# EAGLE design debouncersimple (EAGLE 9.4.2)
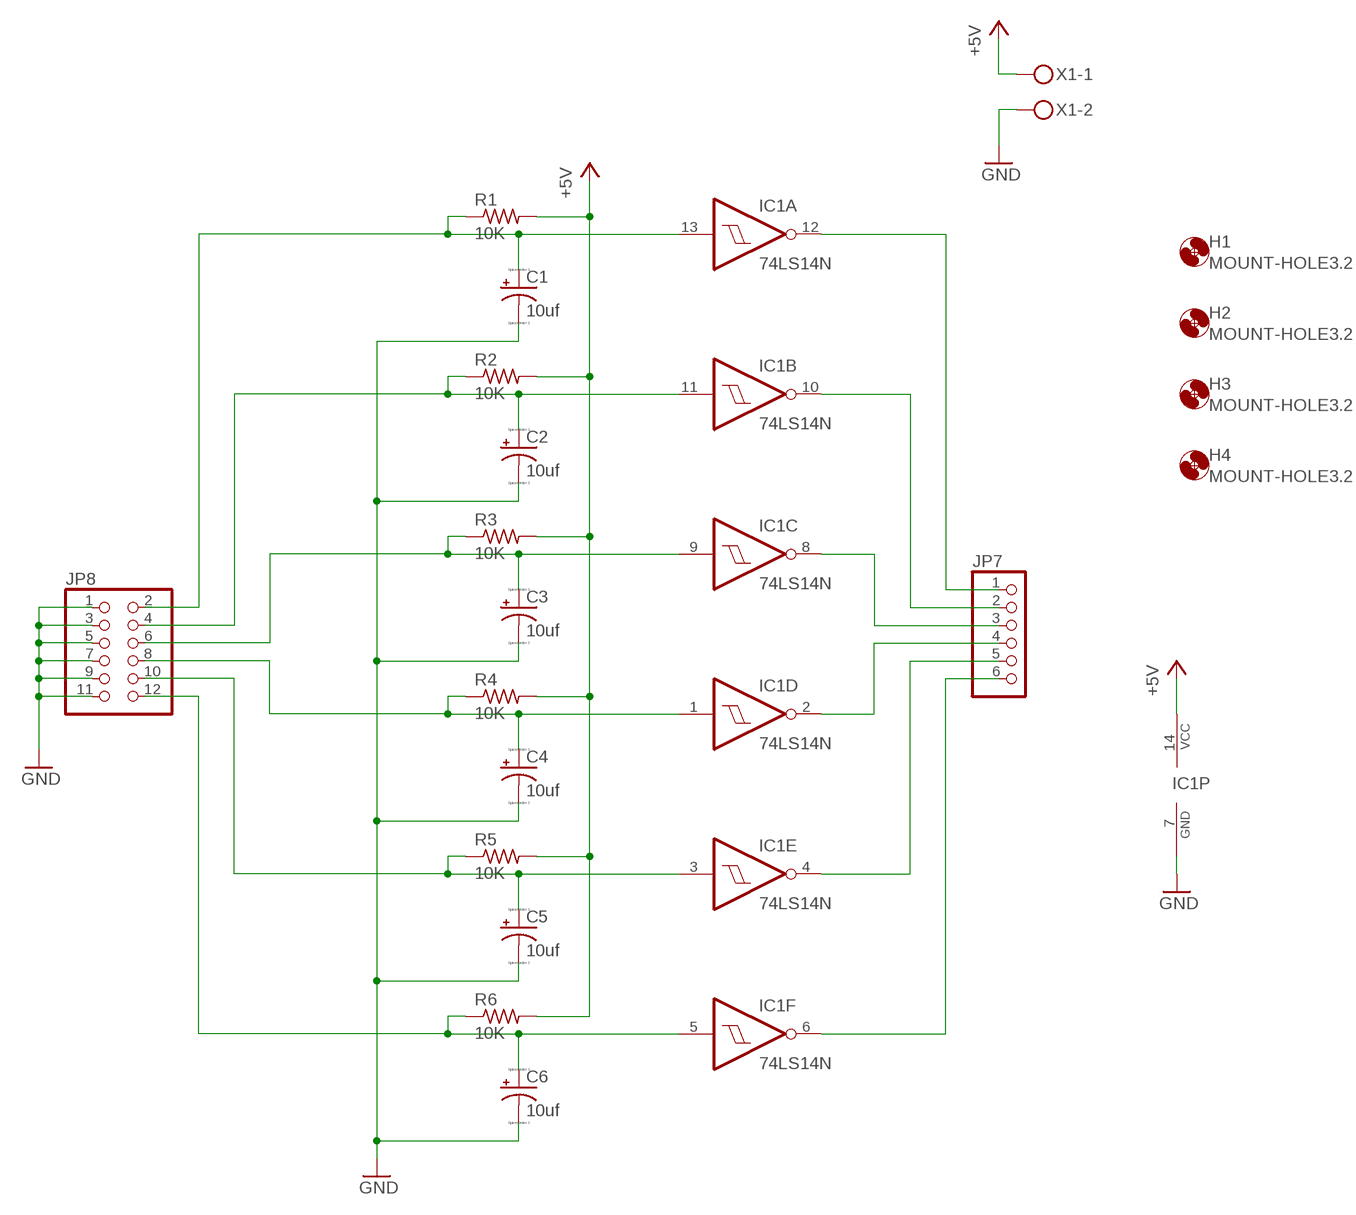
[diagram p0: schematic, sheet 1]

## Parts
C1  10uf  CPOL-USE2-5  [E2-5]
C2  10uf  CPOL-USE2-5  [E2-5]
C3  10uf  CPOL-USE2-5  [E2-5]
C4  10uf  CPOL-USE2-5  [E2-5]
C5  10uf  CPOL-USE2-5  [E2-5]
C6  10uf  CPOL-USE2-5  [E2-5]
H1  MOUNT-HOLE3.2  [3,2]
H2  MOUNT-HOLE3.2  [3,2]
H3  MOUNT-HOLE3.2  [3,2]
H4  MOUNT-HOLE3.2  [3,2]
IC1  74LS14N  [DIL14]
JP7  PINHD-1X6  [1X06]
JP8  PINHD-2X6  [2X06]
R1  10K  R-US_0207/2V  [0207/2V]
R2  10K  R-US_0207/2V  [0207/2V]
R3  10K  R-US_0207/2V  [0207/2V]
R4  10K  R-US_0207/2V  [0207/2V]
R5  10K  R-US_0207/2V  [0207/2V]
R6  10K  R-US_0207/2V  [0207/2V]
X1  MKDSN1,5/2-5,08  [MKDSN1,5/2-5,08]

## Nets
+5V: IC1.14(P:VCC) R1.2 R2.2 R3.2 R4.2 R5.2 R6.2 X1.1
GND: C1.- C2.- C3.- C4.- C5.- C6.- IC1.7(P:GND) JP8.1 JP8.3 JP8.5 JP8.7 JP8.9 JP8.11 X1.2
N$1: C1.+ IC1.13(A:I) JP8.2 R1.1
N$2: IC1.6(F:O) JP7.6
N$3: IC1.4(E:O) JP7.5
N$4: IC1.2(D:O) JP7.4
N$5: C2.+ IC1.11(B:I) JP8.4 R2.1
N$6: IC1.8(C:O) JP7.3
N$7: IC1.10(B:O) JP7.2
N$8: C3.+ IC1.9(C:I) JP8.6 R3.1
N$9: IC1.12(A:O) JP7.1
N$11: C4.+ IC1.1(D:I) JP8.8 R4.1
N$14: C5.+ IC1.3(E:I) JP8.10 R5.1
N$17: C6.+ IC1.5(F:I) JP8.12 R6.1

## Library data of the parts
C1-C6 = resistor:CPOL-US: POLARIZED CAPACITOR, American symbol
H1-H4 = holes:MOUNT-HOLE: MOUNTING HOLE with drill center marker
IC1 = 74xx-us:74*14: Hex schmitt trigger INVERTER
JP7 = pinhead:PINHD-1X6: PIN HEADER
JP8 = pinhead:PINHD-2X6: PIN HEADER
R1-R6 = resistor:R-US_: RESISTOR, American symbol
X1 = con-phoenix-508:MKDSN1,5/2-5,08: MKDSN 1,5/ 2-5,08 Printklemme Nennstrom: 13,5 A Nennspannung: 250 V Rastermaß: 5,08 mm Polzahl: 2 Anschlussart: Schraubanschluss Montage: Löten Anschlussrichtung Leiter/Platine: 0 ° Artikelnummer: 1729128 Source: http://eshop.phoenixcontact.com .. 1729128.pdf

## Board
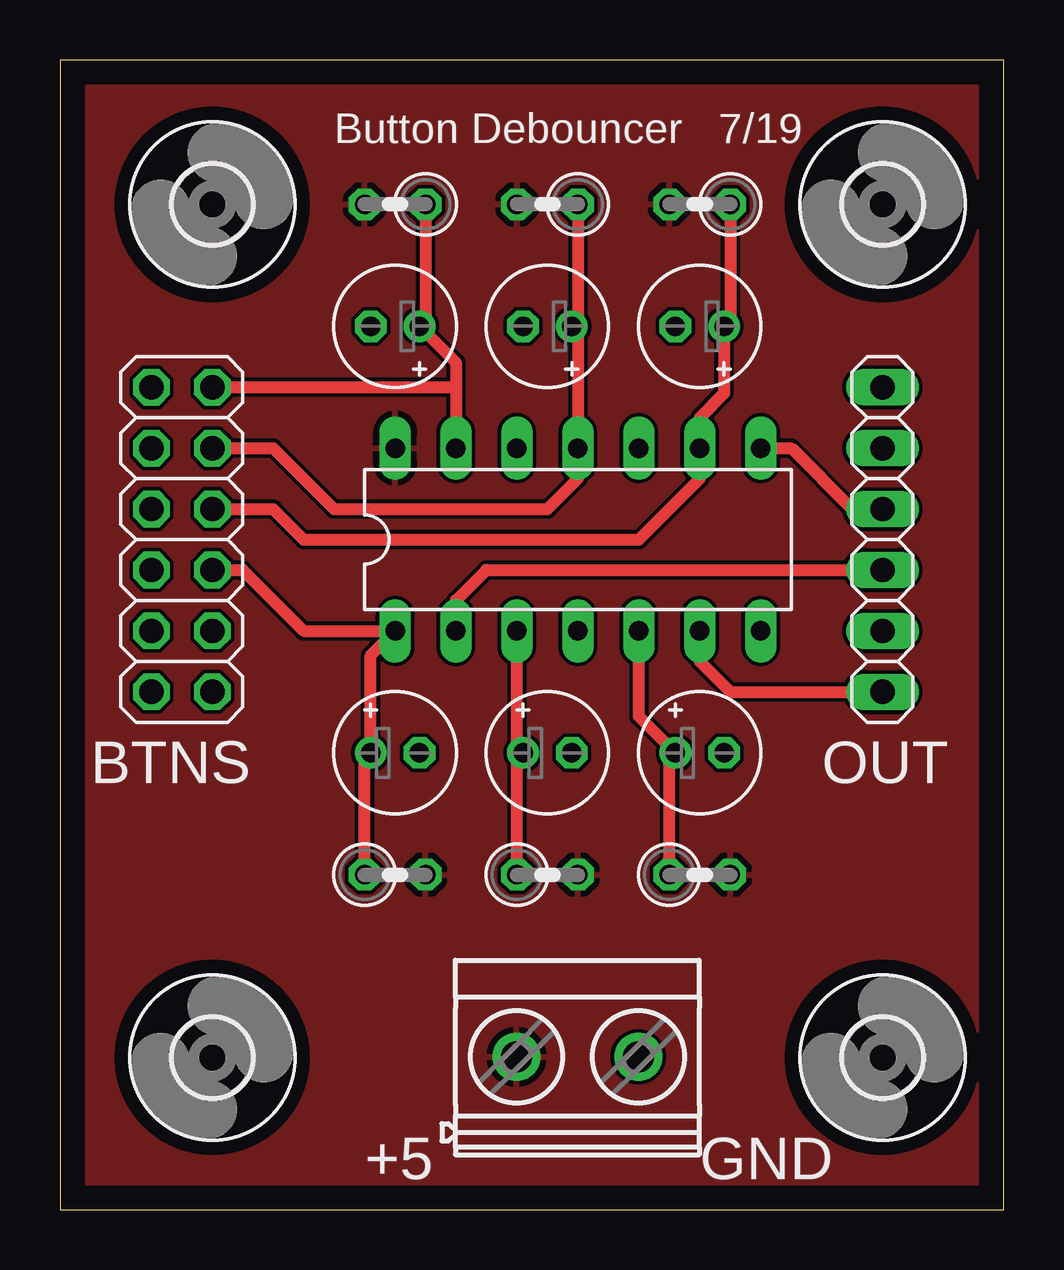
[diagram p1: board, top side]
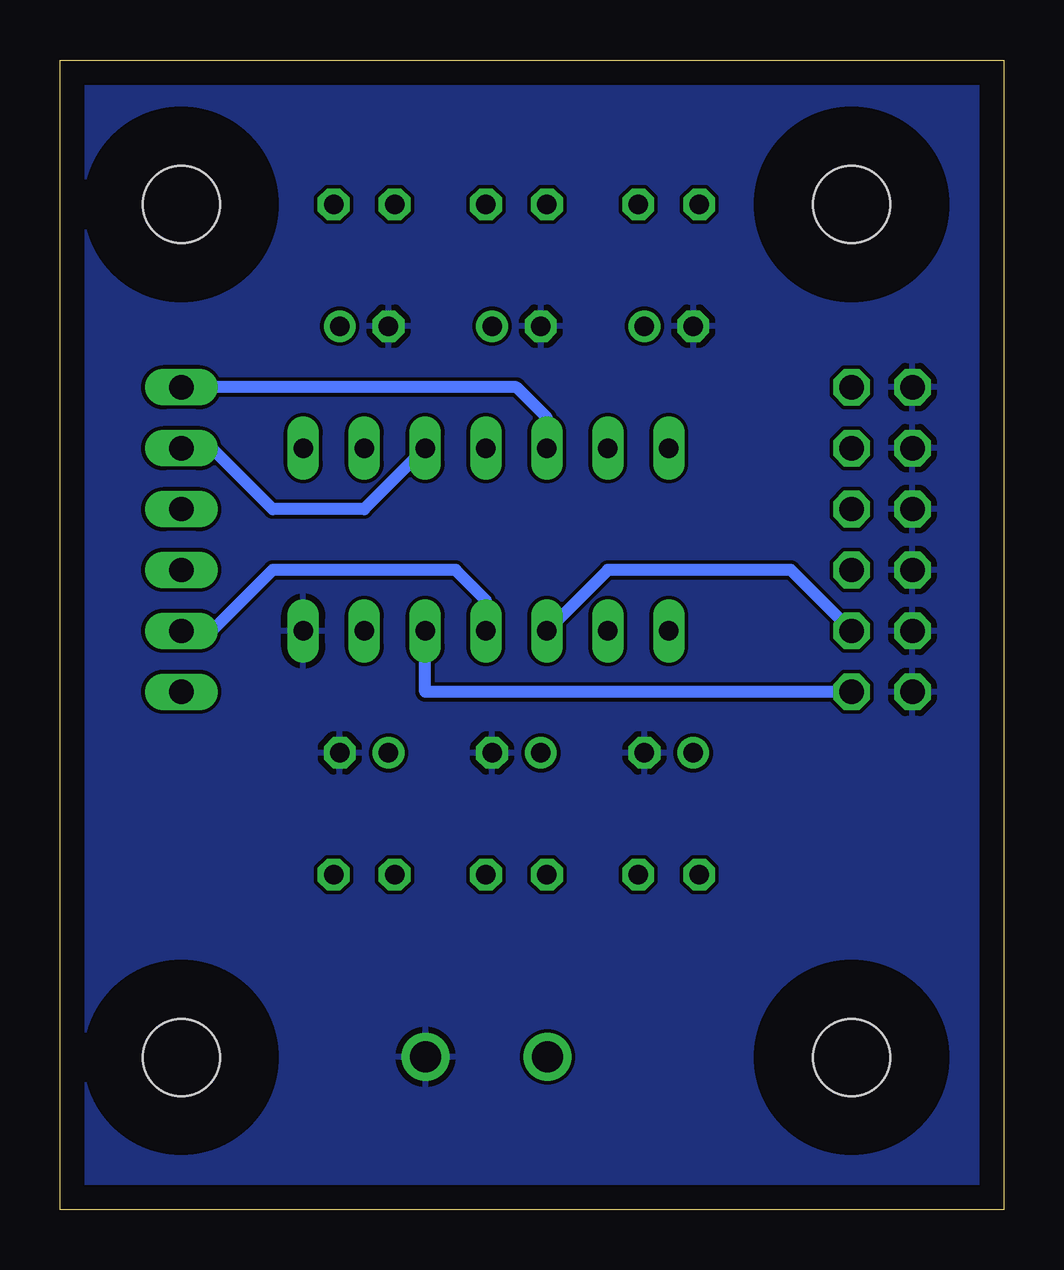
[diagram p2: board, bottom side, seen from below]

Size 39.35 x 47.93 mm. Coordinates in mm from the lower left corner, seen from the top.
Outline: 0,0 39.35,0 39.35,47.93 0,47.93 0,0
Copper layers (1*16): Top 0.035mm / dielectric 1.5mm / Bottom 0.035mm
Design rules "default": minimum track width 6mil, minimum drill 0.35mm, track to track 6mil, track to pad 6mil, pad to pad 6mil, via to via 6mil, smd to smd 6mil, copper to edge 40mil, drill to drill 6mil, minimum pad ring 10mil, minimum via ring 8mil, stop-mask expansion 4mil, vias tented up to drill 0mil, thermal gap 10mil

### Footprints (pad centres in the part's own frame; a part is rotated, then mirrored left to right if it is on the bottom)
E2-5 = drill 0.813 pad 1.27: + -1.016,0 | drill 0.813 pad 1.27 octagon: - 1.016,0
3,2 = hole 3.2: 0,0
DIL14 = drill 0.813 long: 1 -7.62,-3.81; 2 -5.08,-3.81; 3 -2.54,-3.81; 4 0,-3.81; 5 2.54,-3.81; 6 5.08,-3.81; 7 7.62,-3.81; 8 7.62,3.81; 9 5.08,3.81; 10 2.54,3.81; 11 0,3.81; 12 -2.54,3.81; 13 -5.08,3.81; 14 -7.62,3.81
1X06 = drill 1.016 long: 1 -6.35,0; 2 -3.81,0; 3 -1.27,0; 4 1.27,0; 5 3.81,0; 6 6.35,0
2X06 = drill 1.016 octagon: 1 -6.35,-1.27; 2 -6.35,1.27; 3 -3.81,-1.27; 4 -3.81,1.27; 5 -1.27,-1.27; 6 -1.27,1.27; 7 1.27,-1.27; 8 1.27,1.27; 9 3.81,-1.27; 10 3.81,1.27; 11 6.35,-1.27; 12 6.35,1.27
0207/2V = drill 0.813 octagon: 1 -1.27,0; 2 1.27,0
MKDSN1,5/2-5,08 = drill 1.3 pad 2: 1 -2.561,0.025; 2 2.519,0.025

### Placement (x,y rotation side)
C1  13.97,36.83 180 top
C2  20.32,36.83 180 top
C3  26.67,36.83 180 top
C4  13.97,19.05 0 top
C5  20.32,19.05 0 top
C6  26.67,19.05 0 top
H1  34.29,6.35 0 top
H2  6.35,41.91 0 top
H3  34.29,41.91 0 top
H4  6.35,6.35 0 top
IC1  21.59,27.94 0 top
JP7  34.29,27.94 270 top
JP8  5.08,27.94 270 top
R1  13.97,41.91 180 top
R2  20.32,41.91 180 top
R3  26.67,41.91 180 top
R4  13.97,13.97 0 top
R5  20.32,13.97 0 top
R6  26.67,13.97 0 top
X1  21.59,6.35 0 top

### Tracks (layer width: path | path; a pad name or v marks a point on that pad's centre or on a via)
+5V
  pour Top: -5.08,57.15 44.45,57.15 44.45,-3.81 -5.08,-3.81
GND
  pour Bottom: -10.16,53.34 41.91,53.34 41.91,0 -10.16,0
N$1
  Top 0.508: R1.1 15.24,37.08 C1.+ 16.51,35.31 16.51,34.29 | 16.51,34.29 IC1.13 | JP8.2 16.51,34.29
N$2
  Top 0.508: IC1.6 26.67,22.86 27.94,21.59 JP7.6
N$3
  Bottom 0.508: IC1.4 21.59,25.4 22.86,26.67 30.48,26.67 33.02,24.13 JP7.5
N$4
  Top 0.508: IC1.2 16.51,25.4 17.78,26.67 JP7.4
N$5
  Top 0.508: R2.1 21.59,37.08 C2.+ 21.59,36.58 IC1.11 21.59,30.48 20.32,29.21 11.43,29.21 8.89,31.75 JP8.4
N$6
  Top 0.508: IC1.8 30.48,31.75 33.02,29.21 JP7.3
N$7
  Bottom 0.508: IC1.10 26.67,29.21 30.48,29.21 33.02,31.75 JP7.2
N$8
  Top 0.508: R3.1 27.94,37.08 C3.+ 27.69,34.04 26.67,33.02 IC1.9 26.67,30.48 24.13,27.94 10.16,27.94 8.89,29.21 JP8.6
N$9
  Bottom 0.508: IC1.12 19.05,33.02 20.32,34.29 JP7.1
N$11
  Top 0.508: R4.1 12.7,18.8 C4.+ 12.95,23.11 IC1.1 10.16,24.13 7.62,26.67 JP8.8
N$14
  Top 0.508: R5.1 19.05,18.8 C5.+ 19.05,19.3 IC1.3
  Bottom 0.508: JP8.10 8.89,26.67 16.51,26.67 IC1.3
N$17
  Top 0.508: R6.1 25.4,18.8 C6.+ 24.13,20.57 IC1.5
  Bottom 0.508: JP8.12 24.13,21.59 IC1.5

### Text on the board
tNames: Button Debouncer 7/19 | BTNS | OUT | +5 | GND